# Altium project ARES.PrjPcb
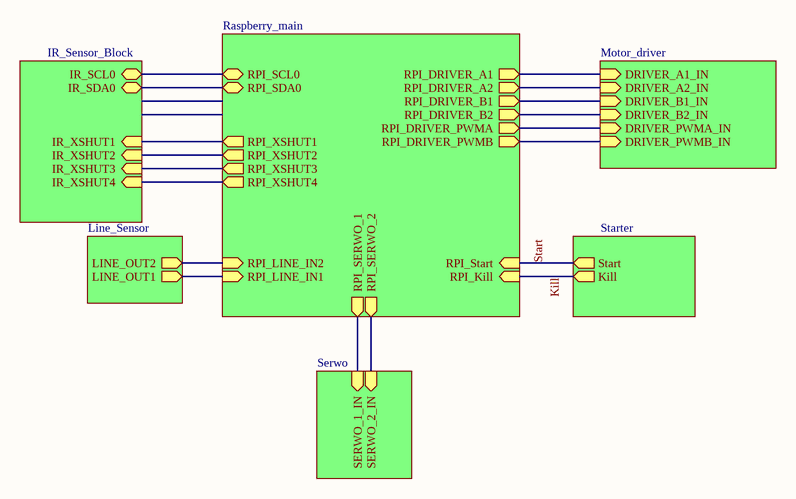
[diagram p0: Main_board.SchDoc]
7 sheets, 18 parts. Net scope: hierarchical (ports join the sheet entries above them; power ports are global).
Board file: PCB.PcbDoc
Sheets:
  Main_board.SchDoc
    U_Raspberry_main = Raspberry_main.SchDoc
    U_motor_driver = Motor_driver.SchDoc
    U_IR_Sensor_Block = IR_Sensor_Block.SchDoc
    U_Line_Sensor = Line_Sensor.SchDoc
    U_Serwo = Serwo.SchDoc
    U_Starter = Starter.SchDoc

## Sheet Main_board.SchDoc
size A4; SheetNumber: 1; SheetTotal: 7

### Sub-sheets
U_IR_Sensor_Block = IR_Sensor_Block: IR_SCL0 (bidir), IR_SDA0 (bidir), IR_XSHUT1 (in), IR_XSHUT2 (in), IR_XSHUT3 (in), IR_XSHUT4 (in)
U_Line_Sensor = Line_Sensor: LINE_OUT1 (out), LINE_OUT2 (out)
U_motor_driver = Motor_driver: DRIVER_A1_IN (in), DRIVER_A2_IN (in), DRIVER_B1_IN (in), DRIVER_B2_IN (in), DRIVER_PWMA_IN (in), DRIVER_PWMB_IN (in)
U_Raspberry_main = Raspberry_main: RPI_LINE_IN1 (in), RPI_LINE_IN2 (in), RPI_SERWO_1 (out), RPI_SERWO_2 (out), RPI_XSHUT1 (out), RPI_XSHUT2 (out), RPI_XSHUT3 (out), RPI_XSHUT4 (out), RPI_DRIVER_A1 (out), RPI_DRIVER_A2 (out), RPI_DRIVER_B1 (out), RPI_DRIVER_B2 (out), RPI_DRIVER_PWMA (out), RPI_DRIVER_PWMB (out), RPI_Start (in), RPI_Kill (in), RPI_SCL0 (bidir), RPI_SDA0 (bidir)
U_Serwo = Serwo: SERWO_2_IN (in), SERWO_1_IN (in)
U_Starter = Starter: Start (out), Kill (out)

### Nets
DRIVER_A1_IN: sheet U_Raspberry_main/RPI_DRIVER_A1, sheet U_motor_driver/DRIVER_A1_IN
DRIVER_A2_IN: sheet U_Raspberry_main/RPI_DRIVER_A2, sheet U_motor_driver/DRIVER_A2_IN
DRIVER_B1_IN: sheet U_Raspberry_main/RPI_DRIVER_B1, sheet U_motor_driver/DRIVER_B1_IN
DRIVER_B2_IN: sheet U_Raspberry_main/RPI_DRIVER_B2, sheet U_motor_driver/DRIVER_B2_IN
DRIVER_PWMA_IN: sheet U_Raspberry_main/RPI_DRIVER_PWMA, sheet U_motor_driver/DRIVER_PWMA_IN
DRIVER_PWMB_IN: sheet U_Raspberry_main/RPI_DRIVER_PWMB, sheet U_motor_driver/DRIVER_PWMB_IN
IR_XSHUT1: sheet U_Raspberry_main/RPI_XSHUT1, sheet U_IR_Sensor_Block/IR_XSHUT1
IR_XSHUT2: sheet U_Raspberry_main/RPI_XSHUT2, sheet U_IR_Sensor_Block/IR_XSHUT2
IR_XSHUT3: sheet U_Raspberry_main/RPI_XSHUT3, sheet U_IR_Sensor_Block/IR_XSHUT3
IR_XSHUT4: sheet U_Raspberry_main/RPI_XSHUT4, sheet U_IR_Sensor_Block/IR_XSHUT4
Kill: sheet U_Raspberry_main/RPI_Kill, sheet U_Starter/Kill
LINE_OUT1: sheet U_Raspberry_main/RPI_LINE_IN1, sheet U_Line_Sensor/LINE_OUT1
LINE_OUT2: sheet U_Raspberry_main/RPI_LINE_IN2, sheet U_Line_Sensor/LINE_OUT2
RPI_SERWO_1: sheet U_Raspberry_main/RPI_SERWO_1, sheet U_Serwo/SERWO_1_IN
RPI_SERWO_2: sheet U_Raspberry_main/RPI_SERWO_2, sheet U_Serwo/SERWO_2_IN
SCL0: sheet U_Raspberry_main/RPI_SCL0, sheet U_IR_Sensor_Block/IR_SCL0
SDA0: sheet U_Raspberry_main/RPI_SDA0, sheet U_IR_Sensor_Block/IR_SDA0
Start: sheet U_Raspberry_main/RPI_Start, sheet U_Starter/Start

## Sheet Raspberry_main.SchDoc
size A4; SheetNumber: 2; SheetTotal: 7
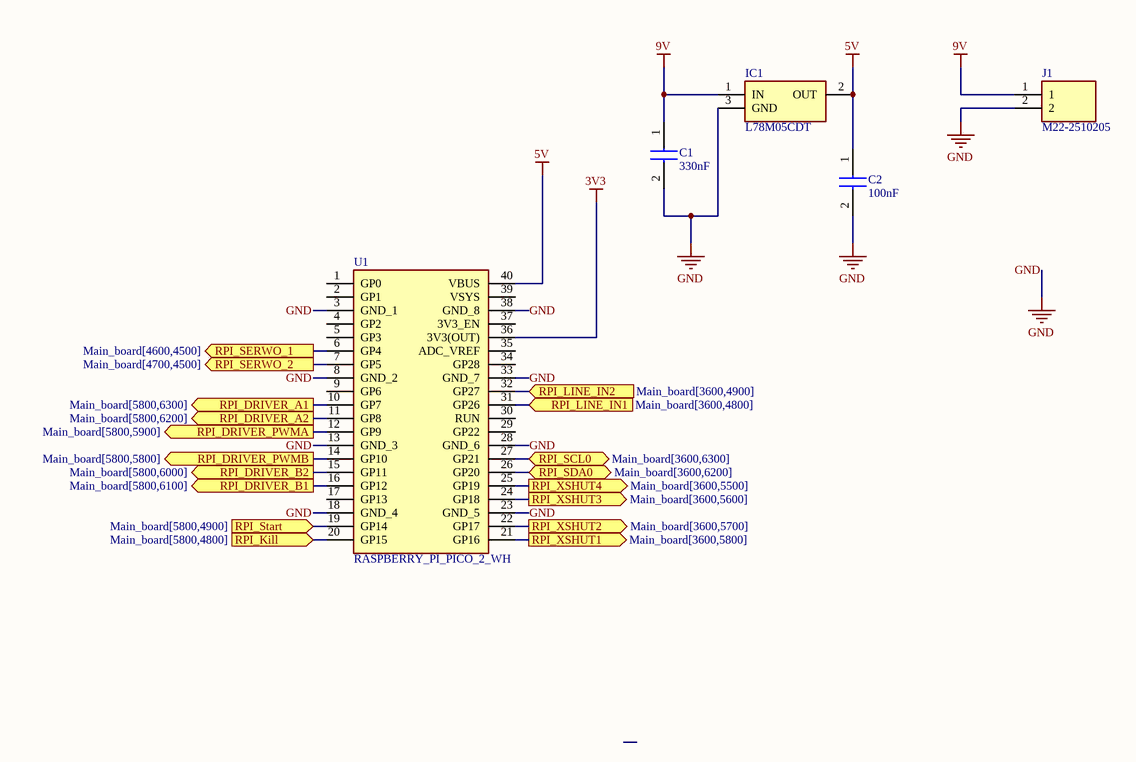
[diagram p1: Raspberry_main.SchDoc]

### Parts
C1  330nF  [CAPC1608X87N]
C2  100nF  [CAPC1608X90N]
IC1  L78M05CDT  [TO225P972X240-3N]
J1  M22-2510205  [PCB 2 pin pads]
U1  RASPBERRY_PI_PICO_2_WH  [RASPBERRYPIPICO2WH]

### Ports
RPI_DRIVER_A1 (out, see Main_board[5800,6300]), RPI_DRIVER_A2 (out, see Main_board[5800,6200]), RPI_DRIVER_B1 (out, see Main_board[5800,6100]), RPI_DRIVER_B2 (out, see Main_board[5800,6000]), RPI_DRIVER_PWMA (out, see Main_board[5800,5900]), RPI_DRIVER_PWMB (out, see Main_board[5800,5800]), RPI_Kill (in, see Main_board[5800,4800]), RPI_LINE_IN1 (in, see Main_board[3600,4800]), RPI_LINE_IN2 (in, see Main_board[3600,4900]), RPI_SCL0 (bidir, see Main_board[3600,6300]), RPI_SDA0 (bidir, see Main_board[3600,6200]), RPI_SERWO_1 (out, see Main_board[4600,4500]), RPI_SERWO_2 (out, see Main_board[4700,4500]), RPI_Start (in, see Main_board[5800,4900]), RPI_XSHUT1 (out, see Main_board[3600,5800]), RPI_XSHUT2 (out, see Main_board[3600,5700]), RPI_XSHUT3 (out, see Main_board[3600,5600]), RPI_XSHUT4 (out, see Main_board[3600,5500])

### Nets
3V3: U1.36(3V3(OUT))
5V: C2.1 IC1.2(OUT) U1.40(VBUS)
9V: C1.1 IC1.1(IN) J1.1
GND: C1.2 C2.2 IC1.3(GND) J1.2 U1.3(GND_1) U1.8(GND_2) U1.13(GND_3) U1.18(GND_4) U1.23(GND_5) U1.28(GND_6) U1.33(GND_7) U1.38(GND_8)
DRIVER_A1_IN: U1.10(GP7) ; port RPI_DRIVER_A1
DRIVER_A2_IN: U1.11(GP8) ; port RPI_DRIVER_A2
DRIVER_B1_IN: U1.16(GP12) ; port RPI_DRIVER_B1
DRIVER_B2_IN: U1.15(GP11) ; port RPI_DRIVER_B2
DRIVER_PWMA_IN: U1.12(GP9) ; port RPI_DRIVER_PWMA
DRIVER_PWMB_IN: U1.14(GP10) ; port RPI_DRIVER_PWMB
IR_XSHUT1: U1.21(GP16) ; port RPI_XSHUT1
IR_XSHUT2: U1.22(GP17) ; port RPI_XSHUT2
IR_XSHUT3: U1.24(GP18) ; port RPI_XSHUT3
IR_XSHUT4: U1.25(GP19) ; port RPI_XSHUT4
Kill: U1.20(GP15) ; port RPI_Kill
LINE_OUT1: U1.31(GP26) ; port RPI_LINE_IN1
LINE_OUT2: U1.32(GP27) ; port RPI_LINE_IN2
RPI_SERWO_1: U1.6(GP4) ; port RPI_SERWO_1
RPI_SERWO_2: U1.7(GP5) ; port RPI_SERWO_2
SCL0: U1.27(GP21) ; port RPI_SCL0
SDA0: U1.26(GP20) ; port RPI_SDA0
Start: U1.19(GP14) ; port RPI_Start

Not connected (* = marked no-connect by the designer): U1 1(GP0) 2(GP1) 4(GP2) 5(GP3) 9(GP6) 17(GP13) 29(GP22) 30(RUN) 34(GP28) 35(ADC_VREF) 37(3V3_EN) 39(VSYS)

### Library data of the parts
C1 = 0603X334K250CT: Capacitor; Manufacturer_Name: PSA; Datasheet Link: https://datasheet.lcsc.com/szlcsc/Huaxin-S-T-0603X334K250CT_C237211.pdf; Height: 0.87mm; Manufacturer_Part_Number: 0603X334K250CT
C2 = 06031C104MAT2A: Capacitor; Manufacturer_Name: Kyocera AVX; Datasheet Link: https://componentsearchengine.com/Datasheets/1/06031A100FAT2A.pdf; Height: 0.9mm; Manufacturer_Part_Number: 06031C104MAT2A; Mouser Part Number: 581-06031C104MAT2A; Mouser Price/Stock: https://www.mouser.co.uk/ProductDetail/KYOCERA-AVX/06031C104MAT2A?qs=%252BdQmOuGyFcGxIE8rM3npkw%3D%3D
IC1 = L78M05CDT: Integrated Circuit; Manufacturer_Name: STMicroelectronics; Datasheet Link: http://componentsearchengine.com/Datasheets/1/L78M05CDT.pdf; Manufacturer_Part_Number: L78M05CDT; Mouser Part Number: 511-L78M05CDT; Mouser Price/Stock: https://www.mouser.co.uk/ProductDetail/STMicroelectronics/L78M05CDT?qs=EYQuxaDwR79rnNxSL0UEZA%3D%3D
J1 = M22-2510205: Connector; Manufacturer_Name: Harwin; Datasheet Link: https://content.harwin.com/m/d9a5a31e6cbac1ad/original/DRG-00499-Technical-Drawing-Datasheet-M22-251-pdf.pdf; Height: 5.25mm; Manufacturer_Part_Number: M22-2510205; Mouser Part Number: 855-M22-2510205; Mouser Price/Stock: https://www.mouser.co.uk/ProductDetail/Harwin/M22-2510205?qs=vF78I%252BjhbY%2FHssMovH2Mxg%3D%3D
U1 = RASPBERRY_PI_PICO_2_WH: Undefined or Miscellaneous; Manufacturer_Name: RASPBERRY-PI; Manufacturer_Part_Number: RASPBERRY PI PICO 2 WH; Datasheet Link: https://datasheets.raspberrypi.com/pico/pico-2-product-brief.pdf; Height: 5mm

## Sheet Motor_driver.SchDoc
size A4; SheetNumber: 3; SheetTotal: 7
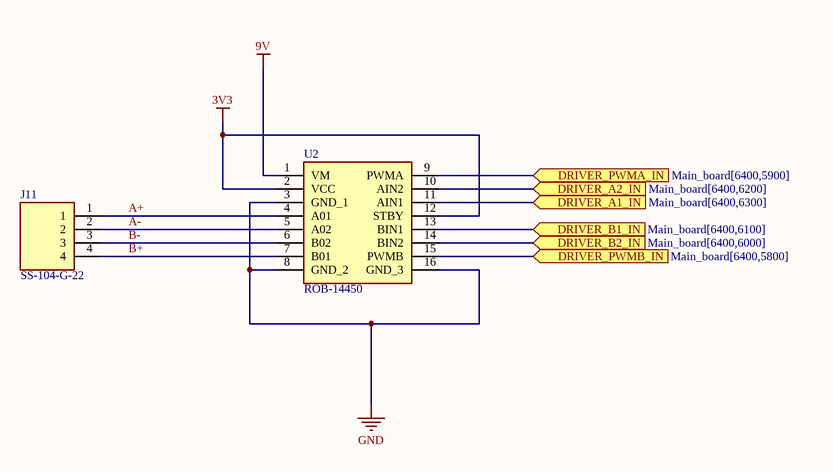
[diagram p2: Motor_driver.SchDoc]

### Parts
J11  SS-104-G-22  [PCB 4 PIN PADS]
U2  ROB-14450  [ROB14450]

### Ports
DRIVER_A1_IN (in, see Main_board[6400,6300]), DRIVER_A2_IN (in, see Main_board[6400,6200]), DRIVER_B1_IN (in, see Main_board[6400,6100]), DRIVER_B2_IN (in, see Main_board[6400,6000]), DRIVER_PWMA_IN (in, see Main_board[6400,5900]), DRIVER_PWMB_IN (in, see Main_board[6400,5800])

### Nets
3V3: U2.2(VCC) U2.12(STBY)
9V: U2.1(VM)
GND: U2.3(GND_1) U2.8(GND_2) U2.16(GND_3)
A+: J11.1 U2.4(A01)
A-: J11.2 U2.5(A02)
B+: J11.4 U2.7(B01)
B-: J11.3 U2.6(B02)
DRIVER_A1_IN: U2.11(AIN1) ; port DRIVER_A1_IN
DRIVER_A2_IN: U2.10(AIN2) ; port DRIVER_A2_IN
DRIVER_B1_IN: U2.13(BIN1) ; port DRIVER_B1_IN
DRIVER_B2_IN: U2.14(BIN2) ; port DRIVER_B2_IN
DRIVER_PWMA_IN: U2.9(PWMA) ; port DRIVER_PWMA_IN
DRIVER_PWMB_IN: U2.15(PWMB) ; port DRIVER_PWMB_IN

### Library data of the parts
J11 = SS-104-G-22: Connector; Manufacturer_Name: SAMTEC; Datasheet Link: http://suddendocs.samtec.com/prints/sx-1xx-xx-xx-x-x-mkt.pdf; Height: 4.44mm; Manufacturer_Part_Number: SS-104-G-22
U2 = ROB-14450: Undefined or Miscellaneous; Manufacturer_Name: SparkFun; Datasheet Link: https://www.sparkfun.com/products/14450; Height: 5mm; Manufacturer_Part_Number: ROB-14450; Mouser Part Number: 474-ROB-14450; Mouser Price/Stock: https://www.mouser.co.uk/ProductDetail/SparkFun/ROB-14450?qs=wd5RIQLrsJhQdlH%2FW5H2aQ%3D%3D; Arrow Part Number: ROB-14450; Arrow Price/Stock: https://www.arrow.com/en/products/rob-14450/sparkfun-electronics?region=nac

## Sheet IR_Sensor_Block.SchDoc
size A4; SheetNumber: 6; SheetTotal: 7
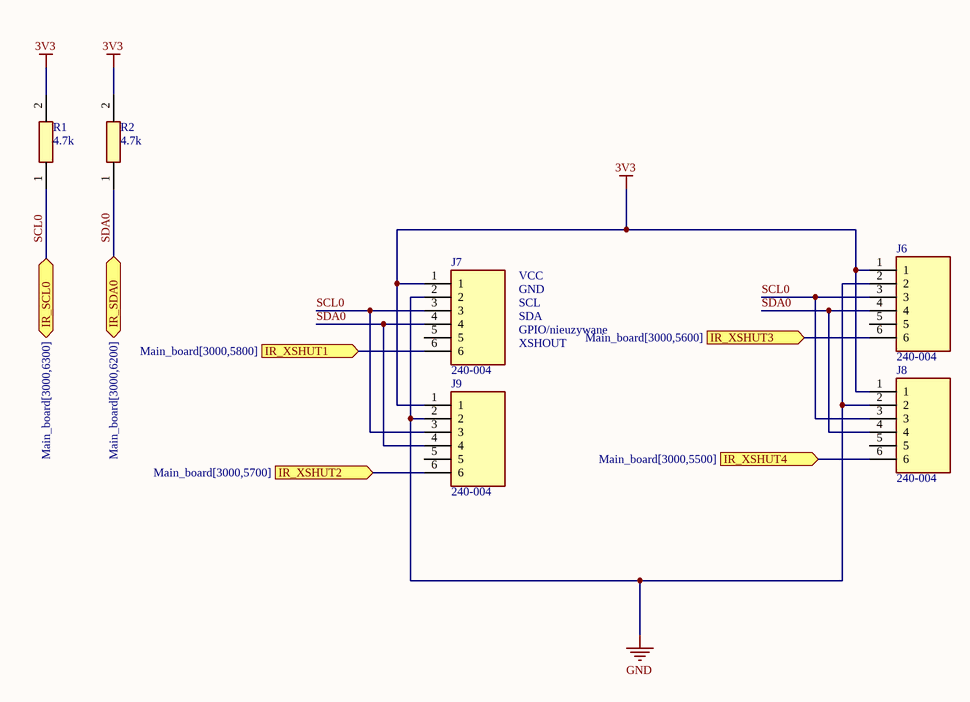
[diagram p3: IR_Sensor_Block.SchDoc]

### Parts
J6  240-004  [HDRV6W64P0X254_1X6_1524X254X909P]
J7  240-004  [HDRV6W64P0X254_1X6_1524X254X909P]
J8  240-004  [HDRV6W64P0X254_1X6_1524X254X909P]
J9  240-004  [HDRV6W64P0X254_1X6_1524X254X909P]
R1  4.7k  [RESC1608X55N]
R2  4.7k  [RESC1608X55N]

### Ports
IR_SCL0 (bidir, see Main_board[3000,6300]), IR_SDA0 (bidir, see Main_board[3000,6200]), IR_XSHUT1 (in, see Main_board[3000,5800]), IR_XSHUT2 (in, see Main_board[3000,5700]), IR_XSHUT3 (in, see Main_board[3000,5600]), IR_XSHUT4 (in, see Main_board[3000,5500])

### Nets
3V3: J6.1 J7.1 J8.1 J9.1 R1.2 R2.2
GND: J6.2 J7.2 J8.2 J9.2
IR_XSHUT1: J7.6 ; port IR_XSHUT1
IR_XSHUT2: J9.6 ; port IR_XSHUT2
IR_XSHUT3: J6.6 ; port IR_XSHUT3
IR_XSHUT4: J8.6 ; port IR_XSHUT4
SCL0: J6.3 J7.3 J8.3 J9.3 R1.1 ; port IR_SCL0
SDA0: J6.4 J7.4 J8.4 J9.4 R2.1 ; port IR_SDA0

Not connected (* = marked no-connect by the designer): J6 5; J7 5; J8 5; J9 5

### Notes on the sheet
- VCC
- GND
- SCL
- SDA
- GPIO/nieuzywane
- XSHOUT

### Library data of the parts
J6-J9 = 240-004: Connector; Manufacturer_Name: Digilent; Datasheet Link: https://digilent.com/reference/_media/reference/test-and-measurement/6-pin-header-gender-changer/163-068-2.pdf; Height: 9.09mm; Manufacturer_Part_Number: 240-004; Arrow Part Number: 240-004; Arrow Price/Stock: https://www.arrow.com/en/products/240-004/digilent?utm_currency=USD&region=nac
R1 R2 = RMCF0603FT4K70: Resistor; Manufacturer_Name: Stackpole Electronics; Datasheet Link: https://www.seielect.com/Catalog/SEI-RMCF_RMCP.pdf; Height: 0.55mm; Manufacturer_Part_Number: RMCF0603FT4K70; Mouser Part Number: 708-RMCF0603FT4K70; Mouser Price/Stock: https://www.mouser.co.uk/ProductDetail/SEI-Stackpole/RMCF0603FT4K70?qs=FESYatJ8odI8oUfeKfwCJw%3D%3D; Arrow Part Number: RMCF0603FT4K70; Arrow Price/Stock: https://www.arrow.com/en/products/rmcf0603ft4k70/stackpole-electronics?utm_currency=USD&region=nac

## Sheet Line_Sensor.SchDoc
size A4; SheetNumber: 5; SheetTotal: 7
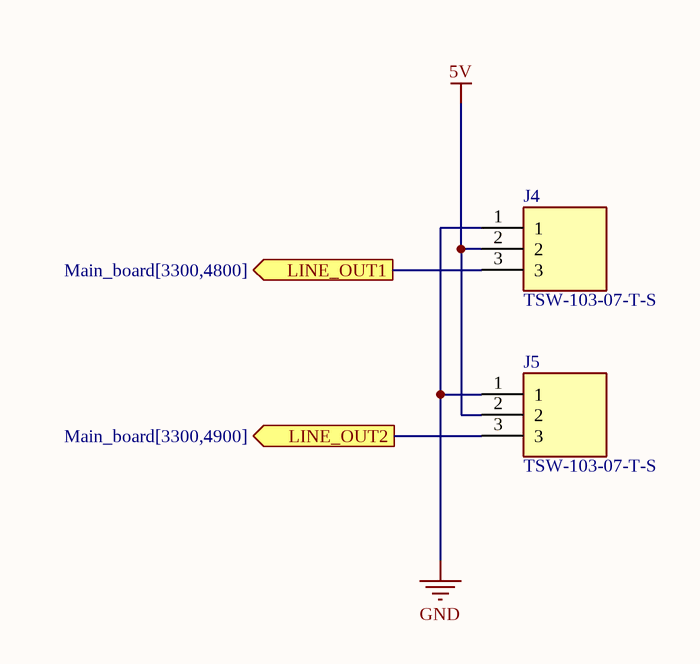
[diagram p4: Line_Sensor.SchDoc]

### Parts
J4  TSW-103-07-T-S  [PCB 3 PIN PADS]
J5  TSW-103-07-T-S  [PCB 3 PIN PADS]

### Ports
LINE_OUT1 (out, see Main_board[3300,4800]), LINE_OUT2 (out, see Main_board[3300,4900])

### Nets
5V: J4.2 J5.2
GND: J4.1 J5.1
LINE_OUT1: J4.3 ; port LINE_OUT1
LINE_OUT2: J5.3 ; port LINE_OUT2

### Library data of the parts
J4 J5 = TSW-103-07-T-S: Connector; Manufacturer_Name: SAMTEC; Datasheet Link: http://suddendocs.samtec.com/prints/tsw-xxx-xx-xxx-x-xx-xxx-mkt.pdf; Manufacturer_Part_Number: TSW-103-07-T-S; Mouser Part Number: 200-TSW10307TS; Mouser Price/Stock: https://www.mouser.co.uk/ProductDetail/Samtec/TSW-103-07-T-S?qs=hzq9O0YpnZs1xDByQQIs%2FQ%3D%3D; Arrow Part Number: TSW-103-07-T-S; Arrow Price/Stock: https://www.arrow.com/en/products/tsw-103-07-t-s/samtec?region=nac

## Sheet Serwo.SchDoc
size A4; SheetNumber: 4; SheetTotal: 7
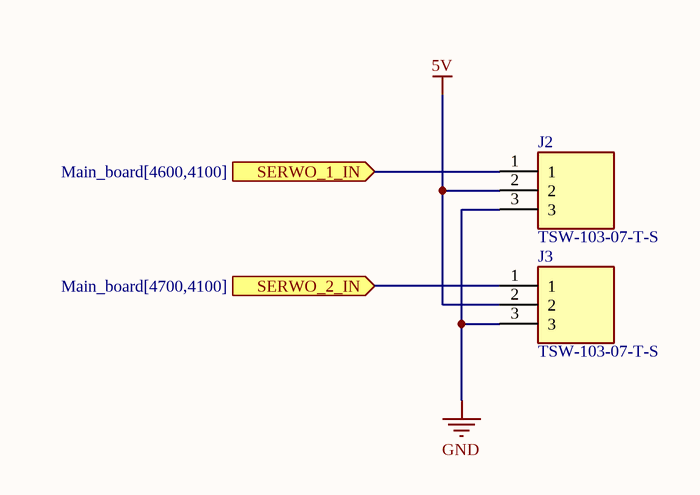
[diagram p5: Serwo.SchDoc]

### Parts
J2  TSW-103-07-T-S  [PCB 3 PIN PADS]
J3  TSW-103-07-T-S  [PCB 3 PIN PADS]

### Ports
SERWO_1_IN (in, see Main_board[4600,4100]), SERWO_2_IN (in, see Main_board[4700,4100])

### Nets
5V: J2.2 J3.2
GND: J2.3 J3.3
RPI_SERWO_1: J2.1 ; port SERWO_1_IN
RPI_SERWO_2: J3.1 ; port SERWO_2_IN

### Library data of the parts
J2 J3 = TSW-103-07-T-S: Connector; Manufacturer_Name: SAMTEC; Datasheet Link: http://suddendocs.samtec.com/prints/tsw-xxx-xx-xxx-x-xx-xxx-mkt.pdf; Manufacturer_Part_Number: TSW-103-07-T-S; Mouser Part Number: 200-TSW10307TS; Mouser Price/Stock: https://www.mouser.co.uk/ProductDetail/Samtec/TSW-103-07-T-S?qs=hzq9O0YpnZs1xDByQQIs%2FQ%3D%3D; Arrow Part Number: TSW-103-07-T-S; Arrow Price/Stock: https://www.arrow.com/en/products/tsw-103-07-t-s/samtec?region=nac

## Sheet Starter.SchDoc
size A4; SheetNumber: 7; SheetTotal: 7
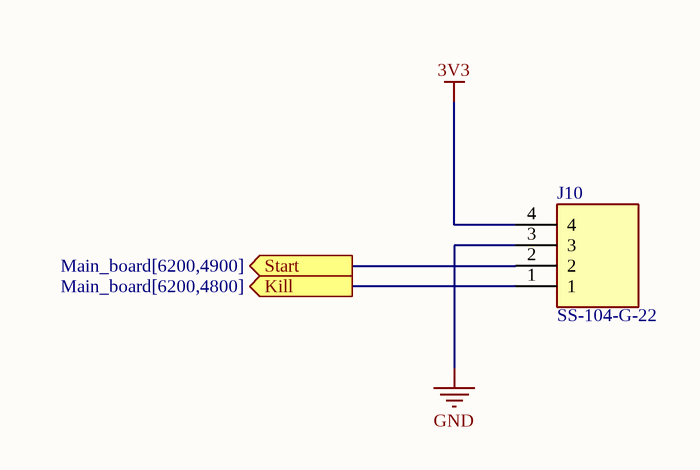
[diagram p6: Starter.SchDoc]

### Parts
J10  SS-104-G-22  [PCB 4 PIN PADS]

### Ports
Kill (out, see Main_board[6200,4800]), Start (out, see Main_board[6200,4900])

### Nets
3V3: J10.4
GND: J10.3
Kill: J10.1 ; port Kill
Start: J10.2 ; port Start

### Library data of the parts
J10 = SS-104-G-22: Connector; Manufacturer_Name: SAMTEC; Datasheet Link: http://suddendocs.samtec.com/prints/sx-1xx-xx-xx-x-x-mkt.pdf; Height: 4.44mm; Manufacturer_Part_Number: SS-104-G-22

## Nets that join several sheets
3V3: Raspberry_main (U1.36), Motor_driver (U2.2 U2.12), IR_Sensor_Block (6 pins), Starter (J10.4)
5V: Raspberry_main (C2.1 IC1.2 U1.40), Line_Sensor (J4.2 J5.2), Serwo (J2.2 J3.2)
9V: Raspberry_main (C1.1 IC1.1 J1.1), Motor_driver (U2.1)
GND: Raspberry_main (12 pins), Motor_driver (U2.3 U2.8 U2.16), IR_Sensor_Block (J6.2 J7.2 J8.2 J9.2), Line_Sensor (J4.1 J5.1), Serwo (J2.3 J3.3), Starter (J10.3)
DRIVER_A1_IN: Raspberry_main (U1.10), Motor_driver (U2.11)
DRIVER_A2_IN: Raspberry_main (U1.11), Motor_driver (U2.10)
DRIVER_B1_IN: Raspberry_main (U1.16), Motor_driver (U2.13)
DRIVER_B2_IN: Raspberry_main (U1.15), Motor_driver (U2.14)
DRIVER_PWMA_IN: Raspberry_main (U1.12), Motor_driver (U2.9)
DRIVER_PWMB_IN: Raspberry_main (U1.14), Motor_driver (U2.15)
IR_XSHUT1: Raspberry_main (U1.21), IR_Sensor_Block (J7.6)
IR_XSHUT2: Raspberry_main (U1.22), IR_Sensor_Block (J9.6)
IR_XSHUT3: Raspberry_main (U1.24), IR_Sensor_Block (J6.6)
IR_XSHUT4: Raspberry_main (U1.25), IR_Sensor_Block (J8.6)
Kill: Raspberry_main (U1.20), Starter (J10.1)
LINE_OUT1: Raspberry_main (U1.31), Line_Sensor (J4.3)
LINE_OUT2: Raspberry_main (U1.32), Line_Sensor (J5.3)
RPI_SERWO_1: Raspberry_main (U1.6), Serwo (J2.1)
RPI_SERWO_2: Raspberry_main (U1.7), Serwo (J3.1)
SCL0: Raspberry_main (U1.27), IR_Sensor_Block (5 pins)
SDA0: Raspberry_main (U1.26), IR_Sensor_Block (5 pins)
Start: Raspberry_main (U1.19), Starter (J10.2)